# Altium schematic sheet 19 CAN转接.SchDoc
size A3
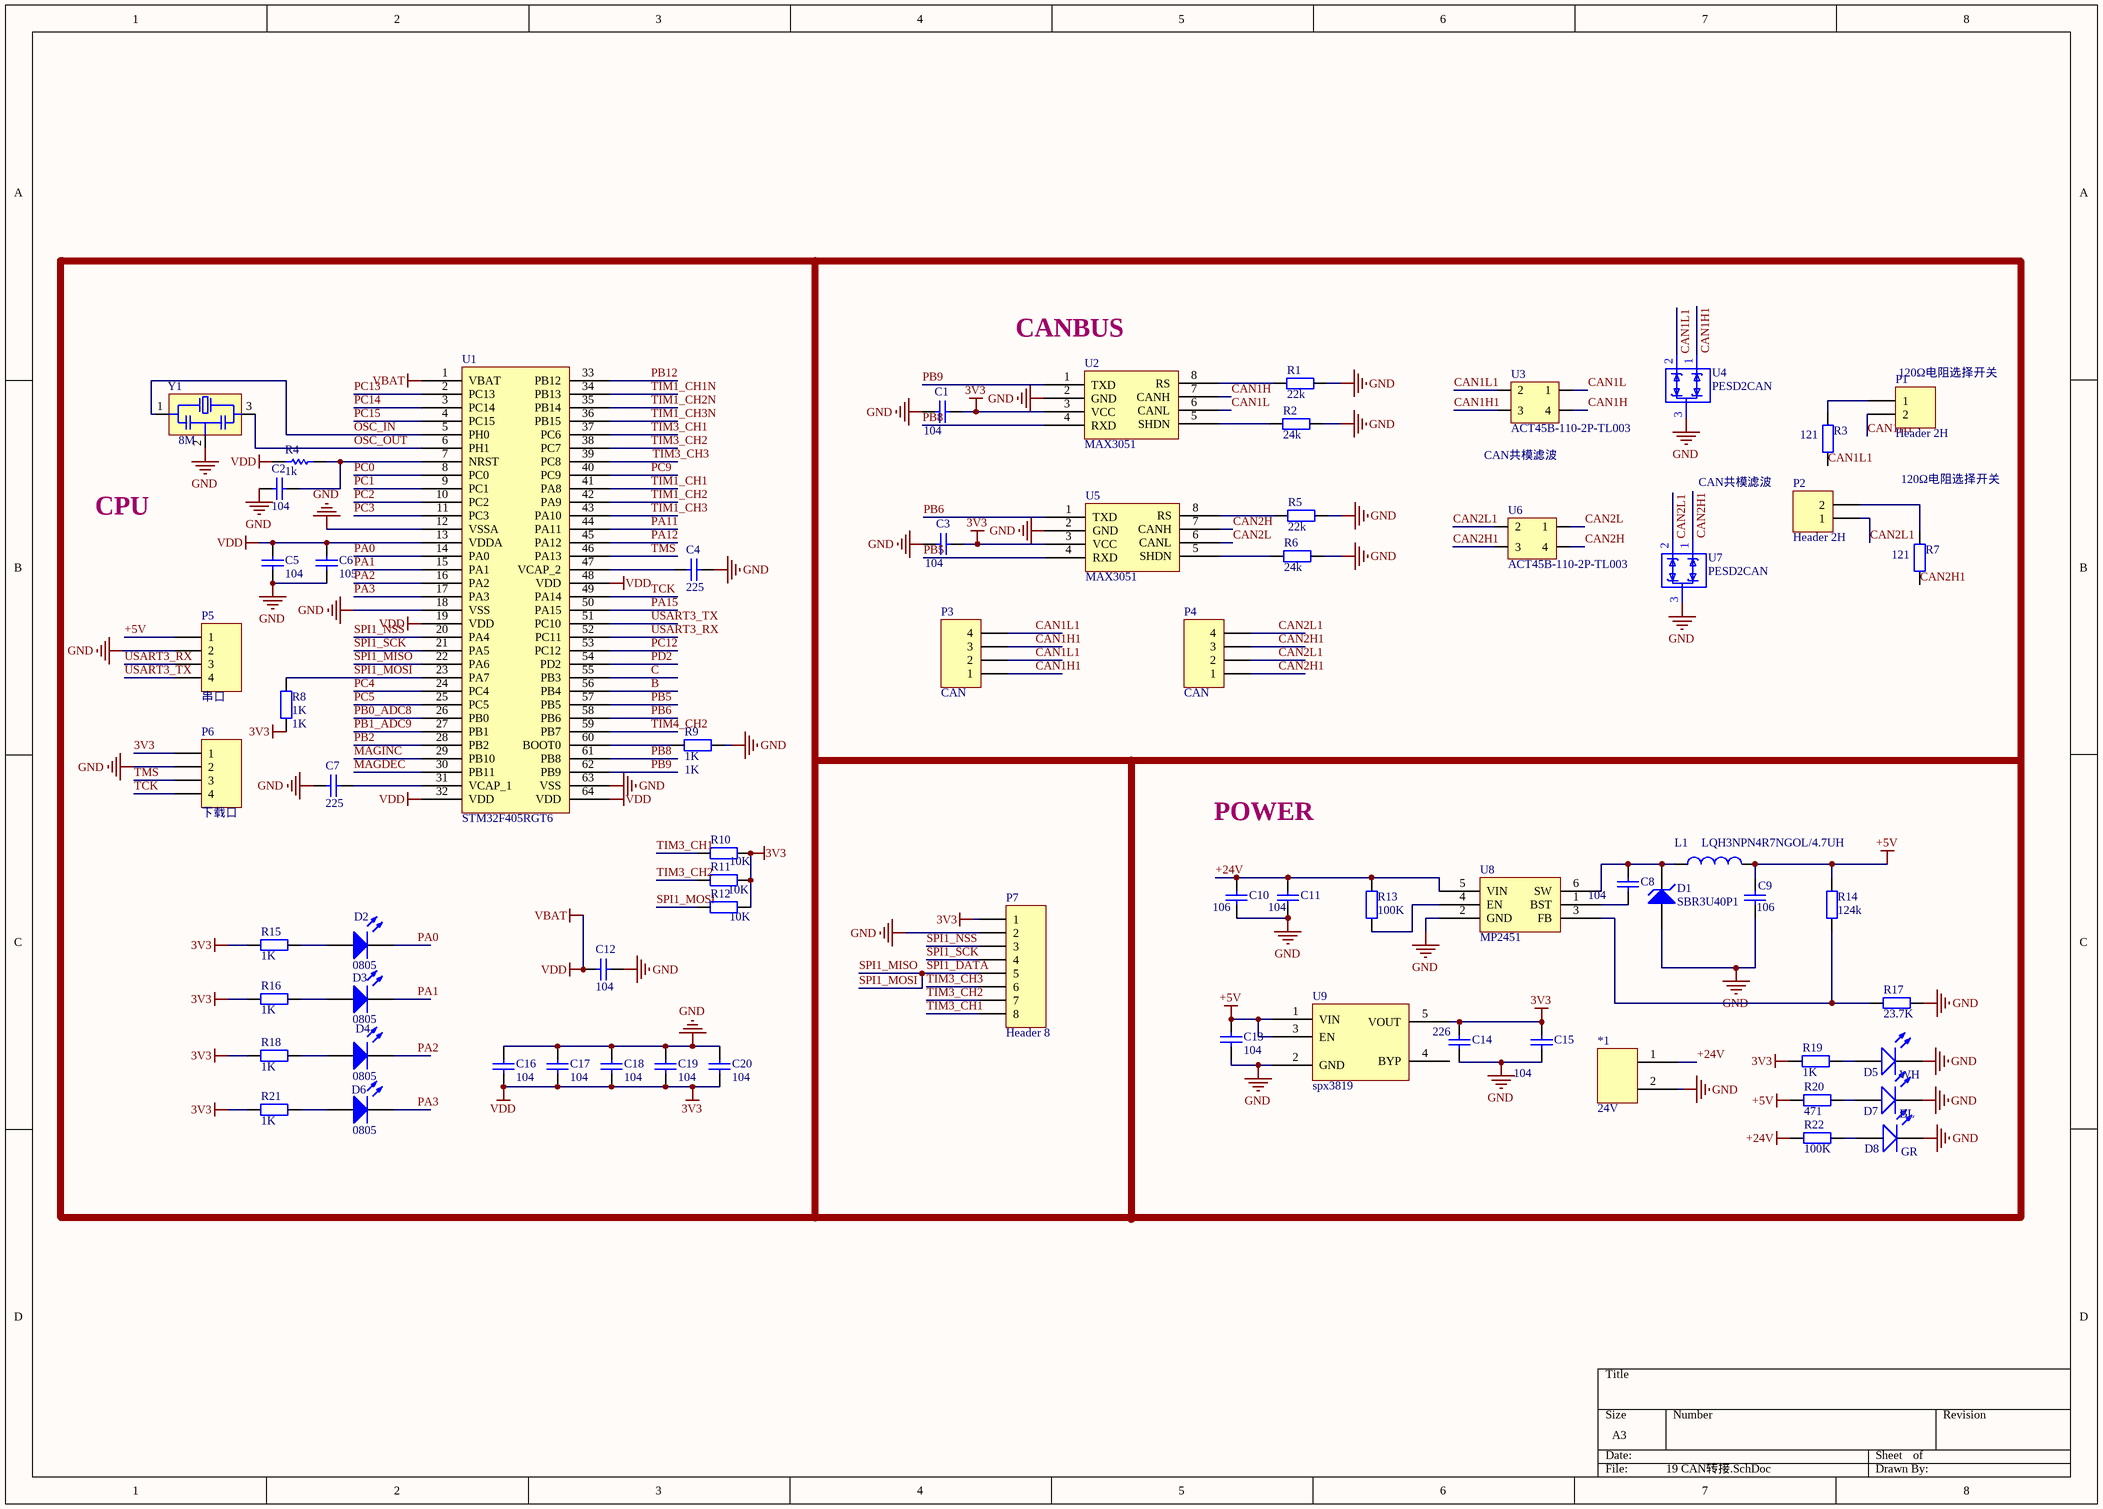
[diagram p0: 19 CAN转接.SchDoc]

## Parts
*1  24V  [J-XH-2A]
C1  104  [0402_C]
C2  104  [0603_C]
C3  104  [0402_C]
C4  225  [0603_C]
C5  104  [0603_C]
C6  105  [0603_C]
C7  225  [0603_C]
C8  104  [0603_C]
C9  106  [0805_C]
C10  106  [0805_C]
C11  104  [0805_C]
C12  104  [0603_C]
C13  104  [0603_C]
C14  226  [0603_C]
C15  104  [0603_C]
C16  104  [0603_C]
C17  104  [0603_C]
C18  104  [0603_C]
C19  104  [0603_C]
C20  104  [0603_C]
D1  SBR3U40P1  [D-POWERDI123]
D2  0805  [0603_LED_S1]
D3  0805  [0603_LED_S1]
D4  0805  [0603_LED_S1]
D5  WH  [0603_LED_S1]
D6  0805  [0603_LED_S1]
D7  BL  [0603_LED_S1]
D8  GR  [0603_LED_S1]
L1  LQH3NPN4R7NGOL/4.7UH  [1206_L]
P1  Header 2H  [拨码开关贴片1位 小]
P2  Header 2H  [拨码开关贴片1位 小]
P3  CAN  [J-GH-4P]
P4  CAN  [J-GH-4P]
P5  串口  [J-1.27-4P]
P6  下载口  [J-1.27-4P]
P7  Header 8  [J-GH-8P]
R1  22k  [0603_R]
R2  24k  [0603_R]
R3  121  [0603_R]
R4  1k  [0603_R]
R5  22k  [0603_R]
R6  24k  [0603_R]
R7  121  [0603_R]
R8  1K  [0603_R]
R9  1K  [0603_R]
R10  10K  [0603_R]
R11  10K  [0603_R]
R12  10K  [0603_R]
R13  100K  [0603_R]
R14  124k  [0603_R]
R15  1K  [0603_R]
R16  1K  [0603_R]
R17  23.7K  [0603_R]
R18  1K  [0603_R]
R19  1K  [0603_R]
R20  471  [0603_R]
R21  1K  [0603_R]
R22  100K  [0603_R]
U1  STM32F405RGT6  [LQFP-64]
U2  MAX3051  [SOT-23-8]
U3  ACT45B-110-2P-TL003  [ACT45B]
U4  PESD2CAN  [SOT-233]
U5  MAX3051  [SOT-23-8]
U6  ACT45B-110-2P-TL003  [ACT45B]
U7  PESD2CAN  [SOT-233]
U8  MP2451  [SOT-236]
U9  spx3819  [SOT-235]
Y1  8M  [X-CSTCE8M]

## Nets
3V3: C1.2 C3.2 C5.1 C6.1 C12.1 C14.2 C15.2 C16.1 C17.1 C18.1 C19.1 C20.1 P6.1 P7.1 R4.2 R8.1 R10.2 R11.2 R12.2 R15.1 R16.1 R18.1 R19.1 R21.1 U1.1(VBAT) U1.13(VDDA) U1.19(VDD) U1.32(VDD) U1.48(VDD) U1.64(VDD) U2.3(VCC) U5.3(VCC) U9.5(VOUT)  [also labelled VBAT, VDD]
+5V: C9.2 C13.2 L1.2 P5.1 R14.1 R20.1 U9.1(VIN) U9.3(EN)
+24V: *1.1 C10.2 C11.2 R13.2 R22.1 U8.5(VIN)
GND: *1.2 C1.1 C2.1 C3.1 C4.2 C5.2 C6.2 C7.1 C9.1 C10.1 C11.1 C12.2 C13.1 C14.1 C15.1 C16.2 C17.2 C18.2 C19.2 C20.2 D1.1(A) D5.K D7.K D8.K P5.2 P6.2 P7.2 R1.1 R2.2 R5.1 R6.2 R9.2 R17.1 U1.12(VSSA) U1.18(VSS) U1.63(VSS) U2.2(GND) U4.3 U5.2(GND) U7.3 U8.2(GND) U9.2(GND) Y1.2(GND)
B: U1.56(PB4)
C: U1.55(PB3)
CAN1H: U2.7(CANH) U3.4
CAN1H1: P1.2 P3.1 P3.3 U3.3 U4.1
CAN1L: U2.6(CANL) U3.1
CAN1L1: P3.2 P3.4 R3.1 U3.2 U4.2
CAN2H: U5.7(CANH) U6.4
CAN2H1: P4.1 P4.3 R7.1 U6.3 U7.1
CAN2L: U5.6(CANL) U6.1
CAN2L1: P2.1 P4.2 P4.4 U6.2 U7.2
MAGDEC: U1.30(PB11)
MAGINC: U1.29(PB10)
OSC_IN: U1.5(PH0) Y1.1(OSCIN)
OSC_OUT: U1.6(PH1) Y1.3(OSCOUT)
PA0: D2.K U1.14(PA0)
PA1: D3.K U1.15(PA1)
PA2: D4.K U1.16(PA2)
PA3: D6.K U1.17(PA3)
PA11: U1.44(PA11)
PA12: U1.45(PA12)
PA15: U1.50(PA15)
PB0_ADC8: U1.26(PB0)
PB1_ADC9: U1.27(PB1)
PB2: U1.28(PB2)
PB5: U1.57(PB5) U5.4(RXD)
PB6: U1.58(PB6) U5.1(TXD)
PB8: U1.61(PB8) U2.4(RXD)
PB9: U1.62(PB9) U2.1(TXD)
PB12: U1.33(PB12)
PC0: U1.8(PC0)
PC1: U1.9(PC1)
PC2: U1.10(PC2)
PC3: U1.11(PC3)
PC4: U1.24(PC4)
PC5: U1.25(PC5)
PC9: U1.40(PC9)
PC12: U1.53(PC12)
PC13: U1.2(PC13)
PC14: U1.3(PC14)
PC15: U1.4(PC15)
PD2: U1.54(PD2)
SPI1_DATA: P7.5 R8.2 R12.1 U1.22(PA6) U1.23(PA7)  [also labelled SPI1_MISO, SPI1_MOSI]
SPI1_NSS: P7.3 U1.20(PA4)
SPI1_SCK: P7.4 U1.21(PA5)
TCK: P6.4 U1.49(PA14)
TIM1_CH1: U1.41(PA8)
TIM1_CH1N: U1.34(PB13)
TIM1_CH2: U1.42(PA9)
TIM1_CH2N: U1.35(PB14)
TIM1_CH3: U1.43(PA10)
TIM1_CH3N: U1.36(PB15)
TIM3_CH1: P7.8 R10.1 U1.37(PC6)
TIM3_CH2: P7.7 R11.1 U1.38(PC7)
TIM3_CH3: P7.6 U1.39(PC8)
TIM4_CH2: U1.59(PB7)
TMS: P6.3 U1.46(PA13)
USART3_RX: P5.3 U1.52(PC11)
USART3_TX: P5.4 U1.51(PC10)
NetC2_2: C2.2 R4.1 U1.7(NRST)
NetC4_1: C4.1 U1.47(VCAP_2)
NetC7_2: C7.2 U1.31(VCAP_1)
NetC8_1: C8.1 U8.1(BST)
NetC8_2: C8.2 D1.2(K) L1.1 U8.6(SW)
NetD2_A: D2.A R15.2
NetD3_A: D3.A R16.2
NetD4_A: D4.A R18.2
NetD5_A: D5.A R19.2
NetD6_A: D6.A R21.2
NetD7_A: D7.A R20.2
NetD8_A: D8.A R22.2
NetP1_1: P1.1 R3.2
NetP2_2: P2.2 R7.2
NetR1_2: R1.2 U2.8(RS)
NetR2_1: R2.1 U2.5(SHDN)
NetR5_2: R5.2 U5.8(RS)
NetR6_1: R6.1 U5.5(SHDN)
NetR9_1: R9.1 U1.60(BOOT0)
NetR13_1: R13.1 U8.4(EN)
NetR14_2: R14.2 R17.2 U8.3(FB)

Not connected (* = marked no-connect by the designer): U9 4(BYP)

## Notes on the sheet
- (near U2) CANBUS
- (near P1) 120Ω电阻选择开关
- CPU
- (near U3) CAN共模滤波
- CAN共模滤波
- 120Ω电阻选择开关
- POWER

## Library data of the parts
*1 = 插件
C1 C3 C8 C13 C15 = 0603 100nF (104) 10% 50V: 贴片电容; ComponentLink1Description: 供应商链接; ComponentLink1URL: http://www.szlcsc.com/product/details_15331.html; Package: 0603; Supplier: LC; SuppliersPartNumber: C14663
C2 C5 C12 C17-C20 = Cap: Capacitor; Value: 0.1uF
C4 = Cap: Capacitor; Value: 2.2uF
C6 = Cap: Capacitor; Value: 1uF
C7 = Cap: Capacitor; Value: 2.2uf
C9 C10 = 0805 10uF (106) 10% 25V: 贴片电容; ComponentLink1Description: 供应商链接; ComponentLink1URL: http://www.szlcsc.com/product/details_16532.html; Package: 0805; Supplier: LC; SuppliersPartNumber: C15850
C11 = 0805 100nF(104) 10% 50V: 贴片电容; ComponentLink1Description: 供应商链接; ComponentLink1URL: http://www.szlcsc.com/product/details_50686.html; Package: 0805; Supplier: LC; SuppliersPartNumber: C49678
C14 = 0603 22uF (226) 20% 6.3V: 贴片电容; ComponentLink1Description: 供应商链接; ComponentLink1URL: http://www.szlcsc.com/product/details_60514.html; Package: 0603; Supplier: LC; SuppliersPartNumber: C59461
C16 = Cap: Capacitor; Value: 10uF
D1 = D Zener: Zener Diode
D2-D4 D6 = 0805 蓝灯: 发光二极管; ComponentLink1Description: 供应商链接; ComponentLink1URL: http://www.szlcsc.com/product/details_2666.html; Package: 0805; Supplier: LC; SuppliersPartNumber: C2293
D5 D7 D8 = 0805 白灯: 发光二极管; ComponentLink1Description: 供应商链接; ComponentLink1URL: http://www.szlcsc.com/product/details_35468.html; Package: 0805; Supplier: LC; SuppliersPartNumber: C34499
L1 = Inductor: 4.7uh; Code_IEC: 1005; Code_JEITA: 0402; Value: 4.7uh
P1 P2 = Header 2H: Header, 2-Pin, Right Angle; LatestRevisionDate: 17-Jul-2002; LatestRevisionNote: Re-released for DXP Platform.; Publisher: Altium Limited
P3 P4 = J-4PIN: Header, 4-Pin
P5 P6 = Header 4: Header, 4-Pin
P7 = Header 8: Header, 8-Pin; LatestRevisionDate: 17-Jul-2002; LatestRevisionNote: Re-released for DXP Platform.; Publisher: Altium Limited
R1-R3 R5-R7 = 0603 120Ω (1200) 1%: 贴片电阻; ComponentLink1Description: 供应商链接; ComponentLink1URL: http://www.szlcsc.com/product/details_23514.html; Package: 0603; Supplier: LC; SuppliersPartNumber: C22787
R4 = Res Semi: Semiconductor Resistor; PackageDescription: Axial Device, Thru-Hole; 2 Leads; 0.5 in Pin Spacing; Value: 1k
R8 R9 R15-R18 R21 = Res2: Resistor
  R8 R9: Value: 1K
R10-R12 = 0603 1KΩ (1001) 1%: 贴片电阻; Value: 1K; ComponentLink1Description: 供应商链接; ComponentLink1URL: http://www.szlcsc.com/product/details_21904.html; Package: 0603; Supplier: LC; SuppliersPartNumber: C21190
R13 = 0603 100KΩ (1003) 1%: 贴片电阻; ComponentLink1Description: 供应商链接; ComponentLink1URL: http://www.szlcsc.com/product/details_26546.html; Package: 0603; Supplier: LC; SuppliersPartNumber: C25803
R14 = Res2
R19 = 0603 1KΩ (1001) 1%: 贴片电阻; ComponentLink1Description: 供应商链接; ComponentLink1URL: http://www.szlcsc.com/product/details_21904.html; Package: 0603; Supplier: LC; SuppliersPartNumber: C21190
R20 = 0603 2KΩ (2001) 1%: 贴片电阻; ComponentLink1Description: 供应商链接; ComponentLink1URL: http://www.szlcsc.com/product/details_23702.html; Package: 0603; Supplier: LC; SuppliersPartNumber: C22975
R22 = 0603 10KΩ (1002) 1%: 贴片电阻; ComponentLink1Description: 供应商链接; ComponentLink1URL: http://www.szlcsc.com/product/details_26547.html; Package: 0603; Supplier: LC; SuppliersPartNumber: C25804
U1 = STM32F405RGT7
U2 U5 = MAX3051EKA
U3 U6 = 扼流线圈: B82793C0/S0
U9 = spx5205
Y1 = TXAL-3